# EAGLE design kolorofon (EAGLE 6.6.0)
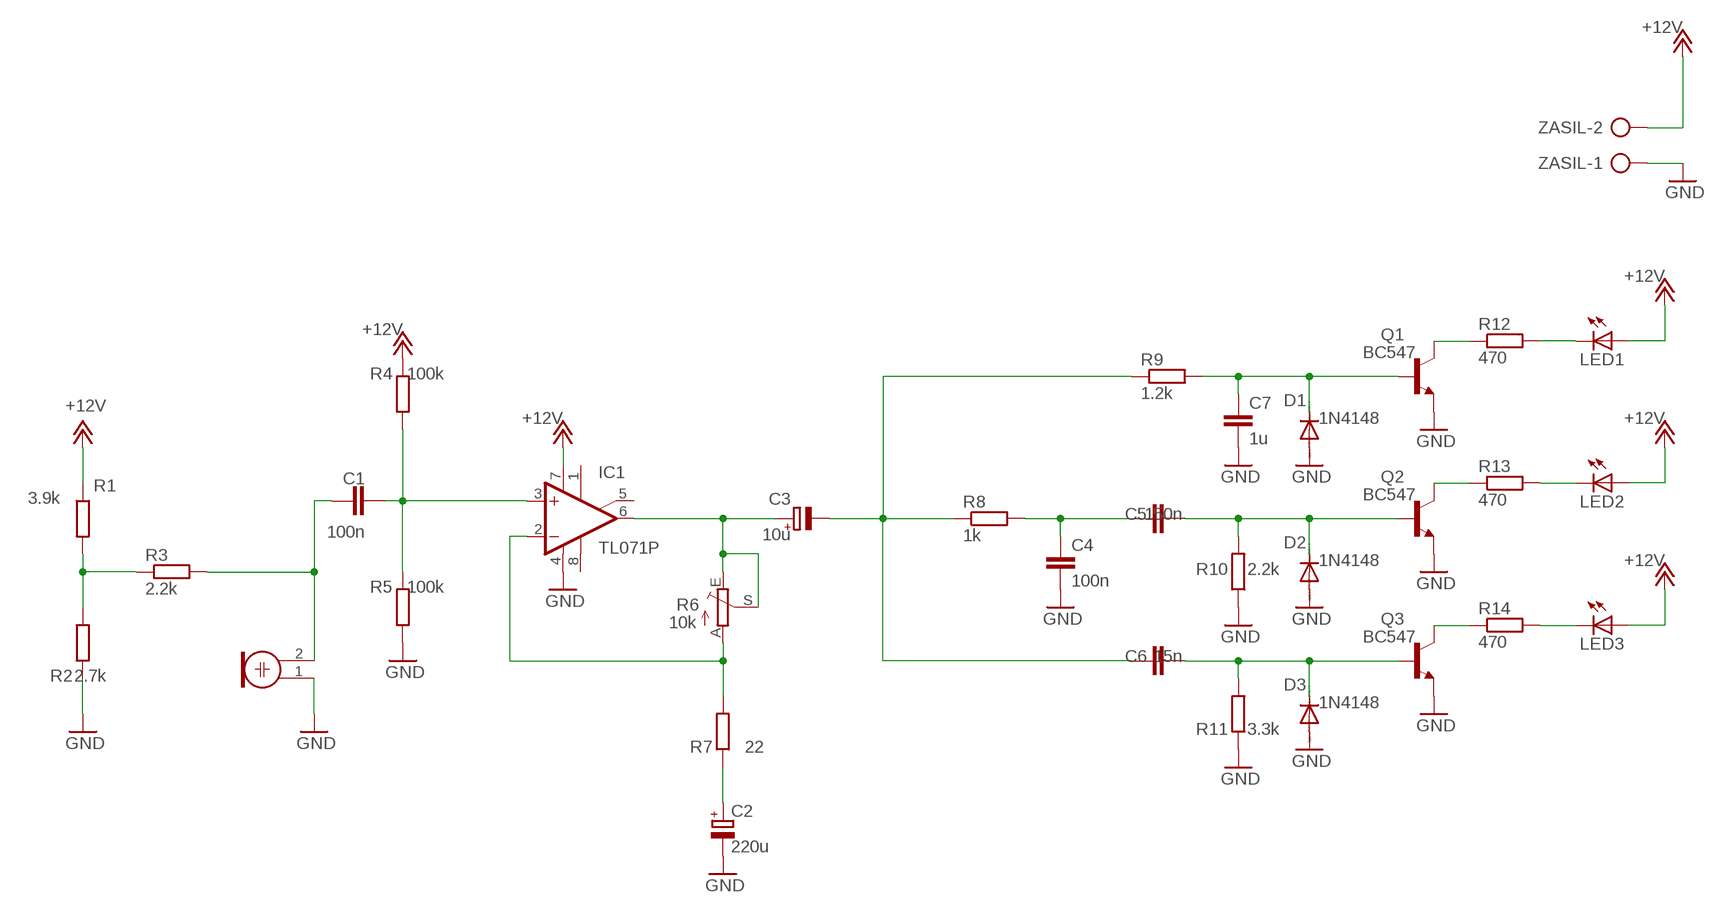
[diagram p0: schematic, sheet 1]

## Parts
C1  100n  C-EU050-025X075  [C050-025X075]
C2  220u  CPOL-EUE2,5-6E  [E2,5-6E]
C3  10u  CPOL-EUE2-5  [E2-5]
C4  100n  C-EU050-025X075  [C050-025X075]
C5  150n  C-EU050-025X075  [C050-025X075]
C6  15n  C-EU050-025X075  [C050-025X075]
C7  1u  C-EU050-045X075  [C050-045X075]
D1  1N4148  1N4148DO35-7  [DO35-7]
D2  1N4148  1N4148DO35-7  [DO35-7]
D3  1N4148  1N4148DO35-7  [DO35-7]
IC1  TL071P  [DIL08]
LED1  LED5MM  [LED5MM]
LED2  LED5MM  [LED5MM]
LED3  LED5MM  [LED5MM]
M1  WM.64PN  ELECTRET_MICROPHON-WM.64PN  [WM-64PN]
Q1  BC547  [TO92]
Q2  BC547  [TO92]
Q3  BC547  [TO92]
R1  3.9k  R-EU_0204/7  [0204/7]
R2  2.7k  R-EU_0204/7  [0204/7]
R3  2.2k  R-EU_0204/7  [0204/7]
R4  100k  R-EU_0204/7  [0204/7]
R5  100k  R-EU_0204/7  [0204/7]
R6  10k  TRIM_EU-S64Y  [S64Y]
R7  22  R-EU_0204/7  [0204/7]
R8  1k  R-EU_0204/7  [0204/7]
R9  1.2k  R-EU_0204/7  [0204/7]
R10  2.2k  R-EU_0204/7  [0204/7]
R11  3.3k  R-EU_0204/7  [0204/7]
R12  470  R-EU_0204/7  [0204/7]
R13  470  R-EU_0204/7  [0204/7]
R14  470  R-EU_0204/7  [0204/7]
ZASIL  AK300/2  [AK300/2]

## Nets
+12V: IC1.7(V+) LED1.A LED2.A LED3.A R1.1 R4.2 ZASIL.2
GND: C2.- C4.2 C7.2 D1.A D2.A D3.A IC1.4(V-) M1.1 Q1.1(E) Q2.1(E) Q3.1(E) R2.1 R5.1 R10.1 R11.1 ZASIL.1
N$1: LED1.K(C) R12.2
N$2: LED2.K(C) R13.2
N$3: LED3.K(C) R14.2
N$4: Q1.3(C) R12.1
N$5: Q2.3(C) R13.1
N$6: Q3.3(C) R14.1
N$7: C7.1 D1.C Q1.2(B) R9.2
N$8: C5.2 D2.C Q2.2(B) R10.2
N$9: C4.1 C5.1 R8.2
N$10: C6.2 D3.C Q3.2(B) R11.2
N$11: C3.- C6.1 R8.1 R9.1
N$12: C3.+ IC1.6(OUT) R6.E R6.S
N$13: IC1.2(-IN) R6.A R7.2
N$14: C2.+ R7.1
N$16: C1.2 IC1.3(+IN) R4.1 R5.2
N$18: C1.1 M1.2 R3.2
N$19: R1.2 R2.2 R3.1
Unconnected: IC1.1(ON1) IC1.5(ON2) IC1.8(OPT)

## Library data of the parts
C1 C4-C7 = rcl:C-EU: CAPACITOR, European symbol
C2 = resistor:CPOL-EU: POLARIZED CAPACITOR, European symbol
C3 = rcl:CPOL-EU: POLARIZED CAPACITOR, European symbol
D1-D3 = diode:1N4148: DIODE high speed (Philips)
IC1 = linear:TL071: OP AMP
LED1-LED3 = led:LED: LED OSRAM: - CHIPLED LG R971, LG N971, LY N971, LG Q971, LY Q971, LO R971, LY R971 LH N974, LH R974 LS Q976, LO Q976, LY Q976 LO Q996 - Hyper CHIPLED LW Q18S LB Q993, LB Q99A, LB R99A - SideLED LS A670, LO A670, LY A670, LG A670, LP A670 LB A673, LV A673, LT A673, LW A673 LH A674 LY A675 LS A676, LA A676, LO A676, LY A676, LW A676 LS A679, LY A679, LG A679 - Hyper Micro SIDELED® LS Y876, LA Y876, LO Y876, LY Y876 LT Y87S - SmartLED LW L88C, LW L88S LB L89C, LB L89S, LG L890 LS L89K, LO L89K, LY L89K LS L896, LA L896, LO L896, LY L896 - TOPLED LS T670, LO T670, LY T670, LG T670, LP T670 LSG T670, LSP T670, LSY T670, LOP T670, LYG T670 LG T671, LOG T671, LSG T671 LB T673, LV T673, LT T673, LW T673 LH T674 LS T676, LA T676, LO T676, LY T676, LB T676, LH T676, LSB T676, LW T676 LB T67C, LV T67C, LT T67C, LS T67K, LO T67K, LY T67K, LW E67C LS E67B, LA E67B, LO E67B, LY E67B, LB E67C, LV E67C, LT E67C LW T67C LS T679, LY T679, LG T679 LS T770, LO T770, LY T770, LG T770, LP T770 LB T773, LV T773, LT T773, LW T773 LH T774 LS E675, LA E675, LY E675, LS T675 LS T776, LA T776, LO T776, LY T776, LB T776 LHGB T686 LT T68C, LB T68C - Hyper Mini TOPLED® LB M676 - Mini TOPLED Santana® LG M470 LS M47K, LO M47K, LY M47K Source: http://www.osram.convergy.de LUXEON: - LUMILED® LXK2-PW12-R00, LXK2-PW12-S00, LXK2-PW14-U00, LXK2-PW14-V00 LXK2-PM12-R00, LXK2-PM12-S00, LXK2-PM14-U00 LXK2-PE12-Q00, LXK2-PE12-R00, LXK2-PE12-S00, LXK2-PE14-T00, LXK2-PE14-U00 LXK2-PB12-K00, LXK2-PB12-L00, LXK2-PB12-M00, LXK2-PB14-N00, LXK2-PB14-P00, LXK2-PB14-Q00 LXK2-PR12-L00, LXK2-PR12-M00, LXK2-PR14-Q00, LXK2-PR14-R00 LXK2-PD12-Q00, LXK2-PD12-R00, LXK2-PD12-S00 LXK2-PH12-R00, LXK2-PH12-S00 LXK2-PL12-P00, LXK2-PL12-Q00, LXK2-PL12-R00 Source: www.luxeon.com KINGBRIGHT: KA-3528ASYC Source: www.kingbright.com
M1 = microphon:ELECTRET_MICROPHON-: Electret Condenser Microphone
Q1-Q3 = transistor-npn:BC547*: NPN Transistor
R1-R5 R7-R14 = rcl:R-EU_: RESISTOR, European symbol
R6 = pot:TRIM_EU-: POTENTIOMETER
ZASIL = con-ptr500:AK300/2: CONNECTOR; OC_FARNELL: unknown; OC_NEWARK: unknown

## Board
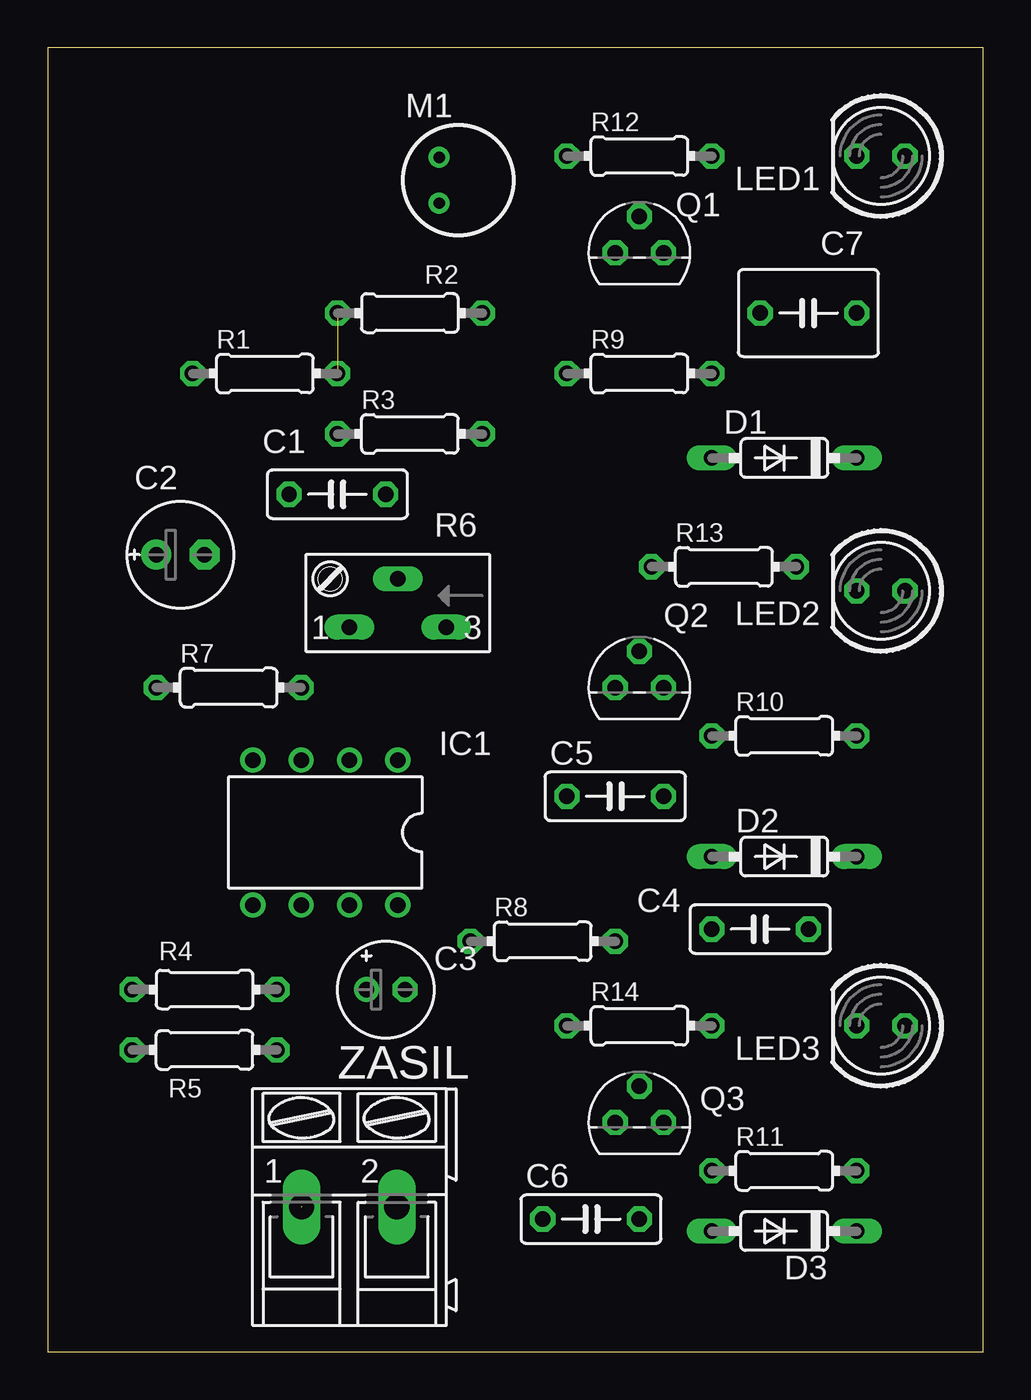
[diagram p1: board, top side]
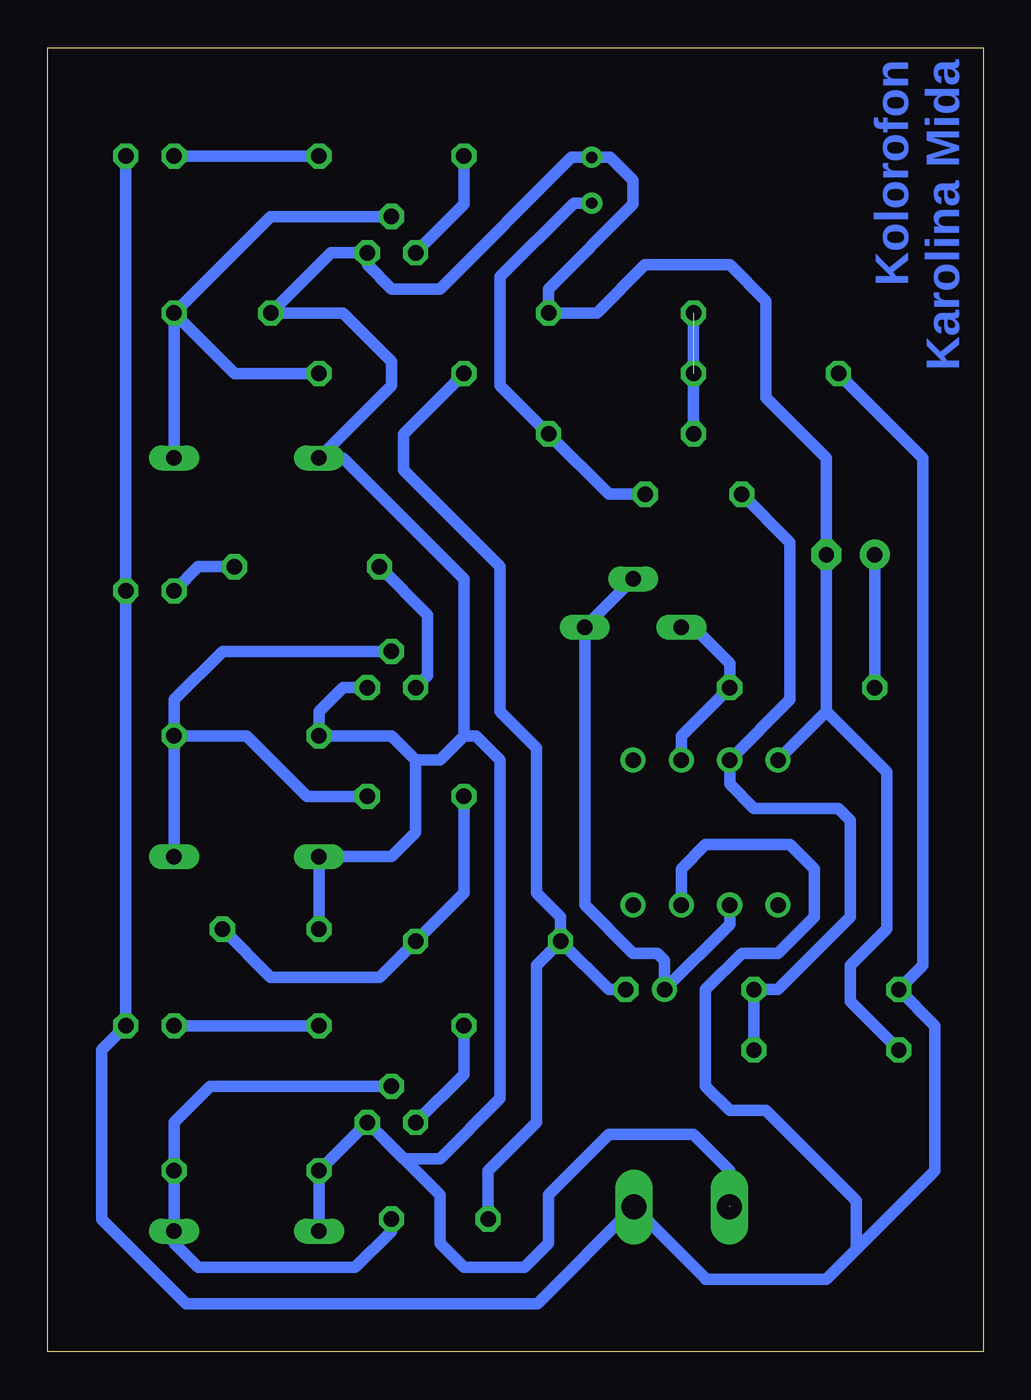
[diagram p2: board, bottom side, seen from below]

Size 49.2 x 68.57 mm. Coordinates in mm from the lower left corner, seen from the top.
Outline: 0,0 49.2,0 49.2,68.57 0,68.57 0,0
Copper layers (1*16): Top 0.035mm / dielectric 1.5mm / Bottom 0.035mm
Design rules "OpenLab": minimum track width 0.4mm, minimum drill 0.6mm, track to track 0.5mm, track to pad 0.5mm, pad to pad 0.5mm, via to via 0.5mm, smd to smd 0.1mm, copper to edge 2mm, drill to drill 0.2mm, minimum pad ring 10mil, minimum via ring 8mil, stop-mask expansion 4mil, vias tented up to drill 0mil, thermal gap 10mil

### Footprints (pad centres in the part's own frame; a part is rotated, then mirrored left to right if it is on the bottom)
C050-025X075 = drill 0.813 octagon: 1 -2.54,0; 2 2.54,0
E2,5-6E = drill 0.813 pad 1.575: + -1.27,0 | drill 0.813 pad 1.575 octagon: - 1.27,0
E2-5 = drill 0.813 pad 1.27: + -1.016,0 | drill 0.813 pad 1.27 octagon: - 1.016,0
C050-045X075 = drill 0.813 octagon: 1 -2.54,0; 2 2.54,0
DO35-7 = drill 0.813 long: A 3.81,0; C -3.81,0
DIL08 = drill 0.813 pad 1.27: 1 -3.81,-3.81; 2 -1.27,-3.81; 3 1.27,-3.81; 4 3.81,-3.81; 5 3.81,3.81; 6 1.27,3.81; 7 -1.27,3.81; 8 -3.81,3.81
LED5MM = drill 0.813 octagon: A -1.27,0; K 1.27,0
WM-64PN = drill 0.6 pad 1: 1 -1,1.204; 2 -1,-1.204
TO92 = drill 0.813 octagon: 1 1.27,0; 2 0,1.905; 3 -1.27,0
0204/7 = drill 0.813 octagon: 1 -3.81,0; 2 3.81,0
S64Y = drill 0.813 long: A 2.54,1.27; E -2.54,1.27; S 0,-1.27
AK300/2 = drill 1.321 long: 1 -2.515,0; 2 2.489,0

### Placement (x,y rotation side)
C1  15.24,45.09 180 top
C2  6.98,41.91 0 top
C3  17.78,19.05 0 top
C4  37.46,22.23 180 top
C5  29.84,29.21 0 top
C6  28.57,6.98 0 top
C7  40.01,54.61 180 top
D1  38.73,46.99 180 top
D2  38.73,26.04 180 top
D3  38.73,6.35 180 top
IC1  14.6,27.3 180 top
LED1  43.81,62.87 180 top
LED2  43.81,40.01 180 top
LED3  43.81,17.15 180 top
M1  21.59,61.6 0 top
Q1  31.12,57.79 0 top
Q2  31.12,34.93 0 top
Q3  31.12,12.07 0 top
R1  11.43,51.43 0 top
R2  19.05,54.61 180 top
R3  19.05,48.26 0 top
R4  8.25,19.05 180 top
R5  8.25,15.88 0 top
R6  18.41,39.37 180 top
R7  9.52,34.93 0 top
R8  26.04,21.59 0 top
R9  31.12,51.43 0 top
R10  38.73,32.38 0 top
R11  38.73,9.53 0 top
R12  31.12,62.87 0 top
R13  35.56,41.27 0 top
R14  31.12,17.15 0 top
ZASIL  15.87,7.62 0 top

### Tracks (layer width: path | path; a pad name or v marks a point on that pad's centre or on a via)
+12V
  Bottom 0.61: LED1.A LED2.A LED3.A 46.35,15.88 46.35,6.98 41.91,2.54 23.44,2.54 ZASIL.2 14.6,3.86 14.6,3.81 8.25,3.81 6.67,5.4 | IC1.7 15.87,25.4 14.6,26.67 10.16,26.67 8.89,25.4 8.89,22.86 10.79,20.95 12.7,20.95 14.6,19.05 14.6,13.97 13.33,12.7 11.43,12.7 6.67,7.94 6.67,5.4 | 6.67,5.4 2.54,9.53 2.54,17.15 R4.2 3.17,20.32 3.17,46.99 R1.1
GND  (1 unrouted)
  Bottom 0.61: Q2.1 33.65,34.93 34.92,33.66 R10.1 31.12,32.38 29.84,31.12 | 29.84,31.12 29.84,27.3 31.12,26.04 D2.A C4.2 | 27.3,32.38 27.3,40.64 33.65,46.99 D1.A 31.12,50.8 31.12,52.07 33.65,54.61 C7.2 34.29,57.79 Q1.1 32.38,57.15 31.12,55.88 28.57,55.88 21.66,62.8 M1.1 19.62,62.8 18.41,61.6 18.41,60.32 22.86,55.88 R2.1 20.32,54.61 17.78,57.15 13.33,57.15 11.43,55.24 11.43,50.16 8.25,46.99 C2.- 8.25,33.66 | D3.A R11.1 Q3.1 | 8.25,33.66 IC1.4 | R5.1 6.98,18.41 6.98,20.32 5.08,22.23 5.08,30.48 8.25,33.66 | 27.3,32.38 28.57,31.12 29.84,31.12 | 13.33,7.64 13.33,9.53 15.24,11.43 19.68,11.43 22.86,8.26 22.86,5.71 24.13,4.45 27.3,4.45 28.57,5.71 28.57,8.26 Q3.1 | Q3.1 30.48,10.16 28.57,10.16 25.4,13.34 25.4,31.12 26.67,32.38 27.3,32.38
N$1
  Bottom 0.61: R12.2 LED1.K
N$2
  Bottom 0.61: R13.2 41.27,41.27 LED2.K
N$3
  Bottom 0.61: LED3.K R14.2
N$4
  Bottom 0.61: R12.1 27.3,60.32 Q1.3
N$5
  Bottom 0.61: R13.1 29.21,38.73 29.21,35.56 Q2.3
N$6
  Bottom 0.61: R14.1 27.3,14.61 Q3.3
N$7
  Bottom 0.61: Q1.2 37.46,59.69 C7.1 | R9.2 39.37,51.43 C7.1 | D1.C C7.1
N$8
  Bottom 0.61: D2.C R10.2 | R10.2 42.54,34.29 40.01,36.83 Q2.2 | C5.2 35.56,29.21 38.73,32.38 R10.2
N$9
  Bottom 0.61: C5.1 27.3,24.13 R8.2 31.75,19.69 37.46,19.69 C4.1
N$10
  Bottom 0.61: Q3.2 40.64,13.97 42.54,12.07 R11.2 D3.C 42.54,5.71 41.27,4.45 33.02,4.45 31.12,6.35 C6.2
N$11
  Bottom 0.61: C6.1 26.04,9.53 23.49,12.07 23.49,20.32 R8.1 | R8.1 22.23,22.86 23.49,24.13 23.49,31.75 25.4,33.66 25.4,41.27 30.48,46.35 30.48,48.26 R9.1 | C3.- 19.68,19.05 R8.1
N$12
  Bottom 0.61: R6.S R6.E 20.95,23.49 18.41,20.95 17.15,20.95 16.76,20.57 C3.+ 13.33,22.48 IC1.6
N$13
  Bottom 0.61: IC1.2 15.87,32.38 R7.2 13.33,36.2 15.24,38.1 R6.A
N$14
  Bottom 0.61: C2.+ R7.1
N$16
  Bottom 0.61: C1.2 10.16,42.55 10.16,34.29 IC1.3 13.33,29.84 12.06,28.58 7.62,28.58 6.98,27.94 6.98,22.86 10.79,19.05 R4.1 R5.2
N$18
  Bottom 0.61: C1.1 19.68,45.09 R3.2 25.4,50.8 25.4,56.52 21.52,60.39 M1.2
N$19  (1 unrouted)
  Bottom 0.61: R3.1 R2.2

### Text on the board
Bottom: Kolorofon / Karolina Mida